# EAGLE schematic BatteryBalancer_SP20 (EAGLE 9.5.0)

## Sheet 1 of 5: Connectors
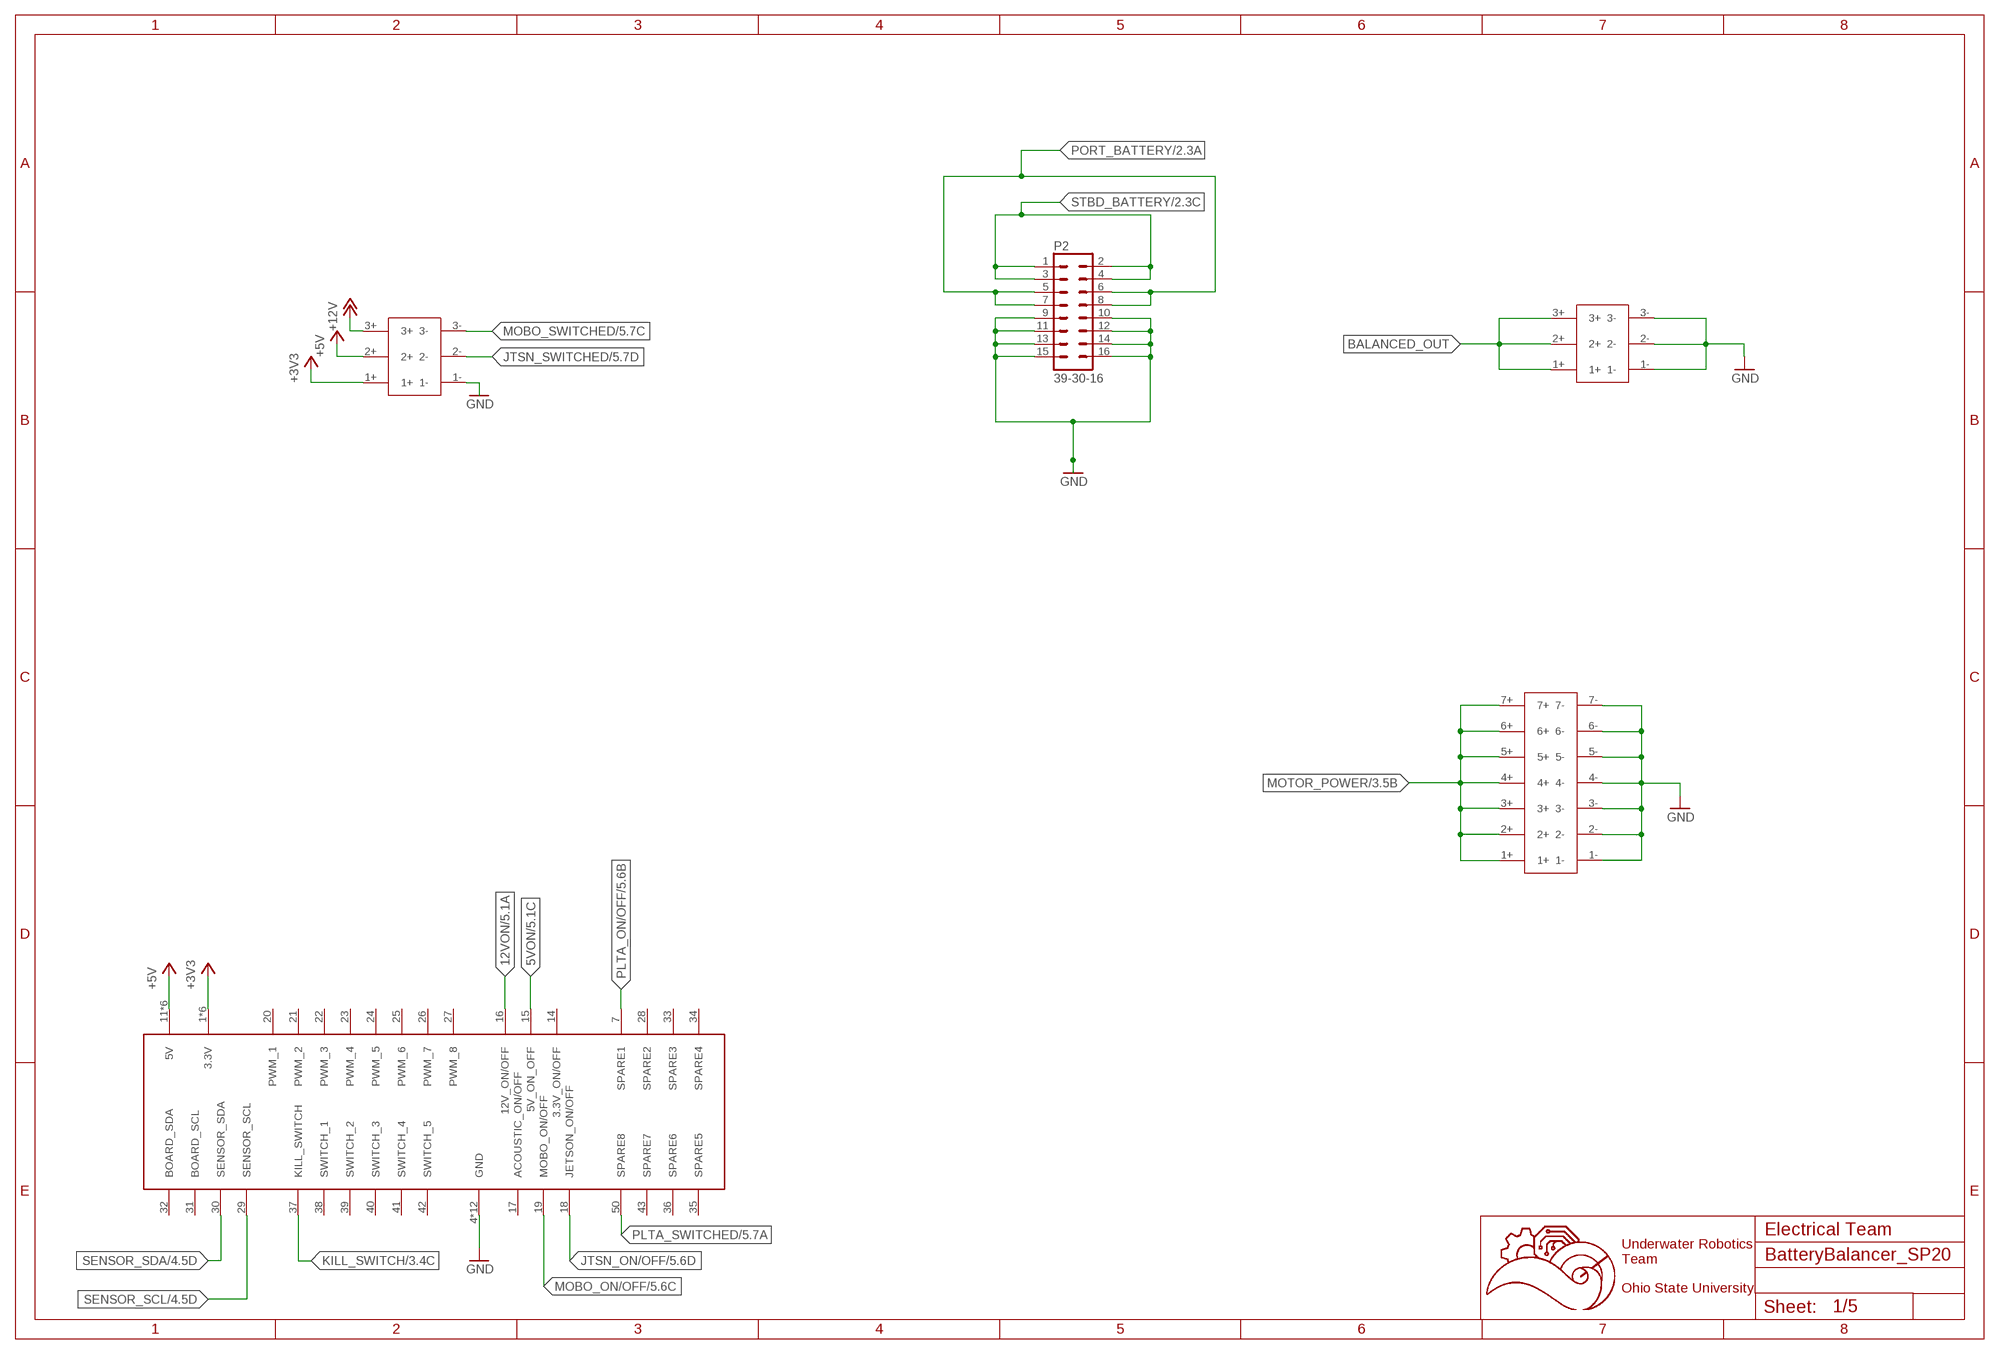
[diagram p0: schematic, sheet 1]

### Parts
P2  39-30-16  [39-30-?16?]
U$1  5530843-EDGE  [5530843-6-BOARDFINGERS]
U$4  14PIN-VERT  [14PIN_VERT]
U$5  6PIN-VERT  [6PIN_VERT]
U$13  6PIN-VERT  [6PIN_VERT]

### Nets
5VON: U$1.15(5V_ON_OFF) ; also sheet 5
12VON: U$1.16(12V_ON/OFF) ; also sheet 5
+3V3: U$1.1(3.3V) U$1.2(3.3V) U$1.3(3.3V) U$1.54(3.3V) U$1.55(3.3V) U$1.56(3.3V) U$5.1+ ; also sheet 2,3,4,5
+5V: U$1.11(5V) U$1.12(5V) U$1.13(5V) U$1.44(5V) U$1.45(5V) U$1.46(5V) U$5.2+ ; also sheet 5
+12V: U$5.3+ ; also sheet 5
BALANCED_OUT: U$13.1+ U$13.2+ U$13.3+ ; also sheet 2,3,4,5
GND: P2.9 P2.10 P2.11 P2.12 P2.13 P2.14 P2.15 P2.16 U$1.4(GND) U$1.5(GND) U$1.6(GND) U$1.8(GND) U$1.9(GND) U$1.10(GND) U$1.47(GND) U$1.48(GND) U$1.49(GND) U$1.51(GND) U$1.52(GND) U$1.53(GND) U$4.1- U$4.2- U$4.3- U$4.4- U$4.5- U$4.6- U$4.7- U$13.1- U$13.2- U$13.3- ; also sheet 2,4,5
GND1: U$5.1- ; supply symbol labelled GND
JTSN_ON/OFF: U$1.18(JETSON_ON/OFF) ; also sheet 5
JTSN_SWITCHED: U$5.2- ; also sheet 5
KILL_SWITCH: U$1.37(KILL_SWITCH) ; also sheet 3
MOBO_ON/OFF: U$1.19(MOBO_ON/OFF) ; also sheet 5
MOBO_SWITCHED: U$5.3- ; also sheet 5
MOTOR_POWER: U$4.1+ U$4.2+ U$4.3+ U$4.4+ U$4.5+ U$4.6+ U$4.7+ ; also sheet 3
PLTA_ON/OFF: U$1.7(SPARE1) ; also sheet 5
PLTA_SWITCHED: U$1.50(SPARE8) ; also sheet 5
PORT_BATTERY: P2.5 P2.6 P2.7 P2.8 ; also sheet 2,4
SENSOR_SCL: U$1.29(SENSOR_SCL) ; also sheet 4
SENSOR_SDA: U$1.30(SENSOR_SDA) ; also sheet 4
STBD_BATTERY: P2.1 P2.2 P2.3 P2.4 ; also sheet 2,4
Unconnected: U$1.14(3.3V_ON/OFF) U$1.17(ACOUSTIC_ON/OFF) U$1.20(PWM_1) U$1.21(PWM_2) U$1.22(PWM_3) U$1.23(PWM_4) U$1.24(PWM_5) U$1.25(PWM_6) U$1.26(PWM_7) U$1.27(PWM_8) U$1.28(SPARE2) U$1.31(BOARD_SCL) U$1.32(BOARD_SDA) U$1.33(SPARE3) U$1.34(SPARE4) U$1.35(SPARE5) U$1.36(SPARE6) U$1.38(SWITCH_1) U$1.39(SWITCH_2) U$1.40(SWITCH_3) U$1.41(SWITCH_4) U$1.42(SWITCH_5) U$1.43(SPARE7)

### Notes on the sheet
- Electrical Team
- Underwater Robotics
  Team
  
  Ohio State University

## Sheet 2 of 5
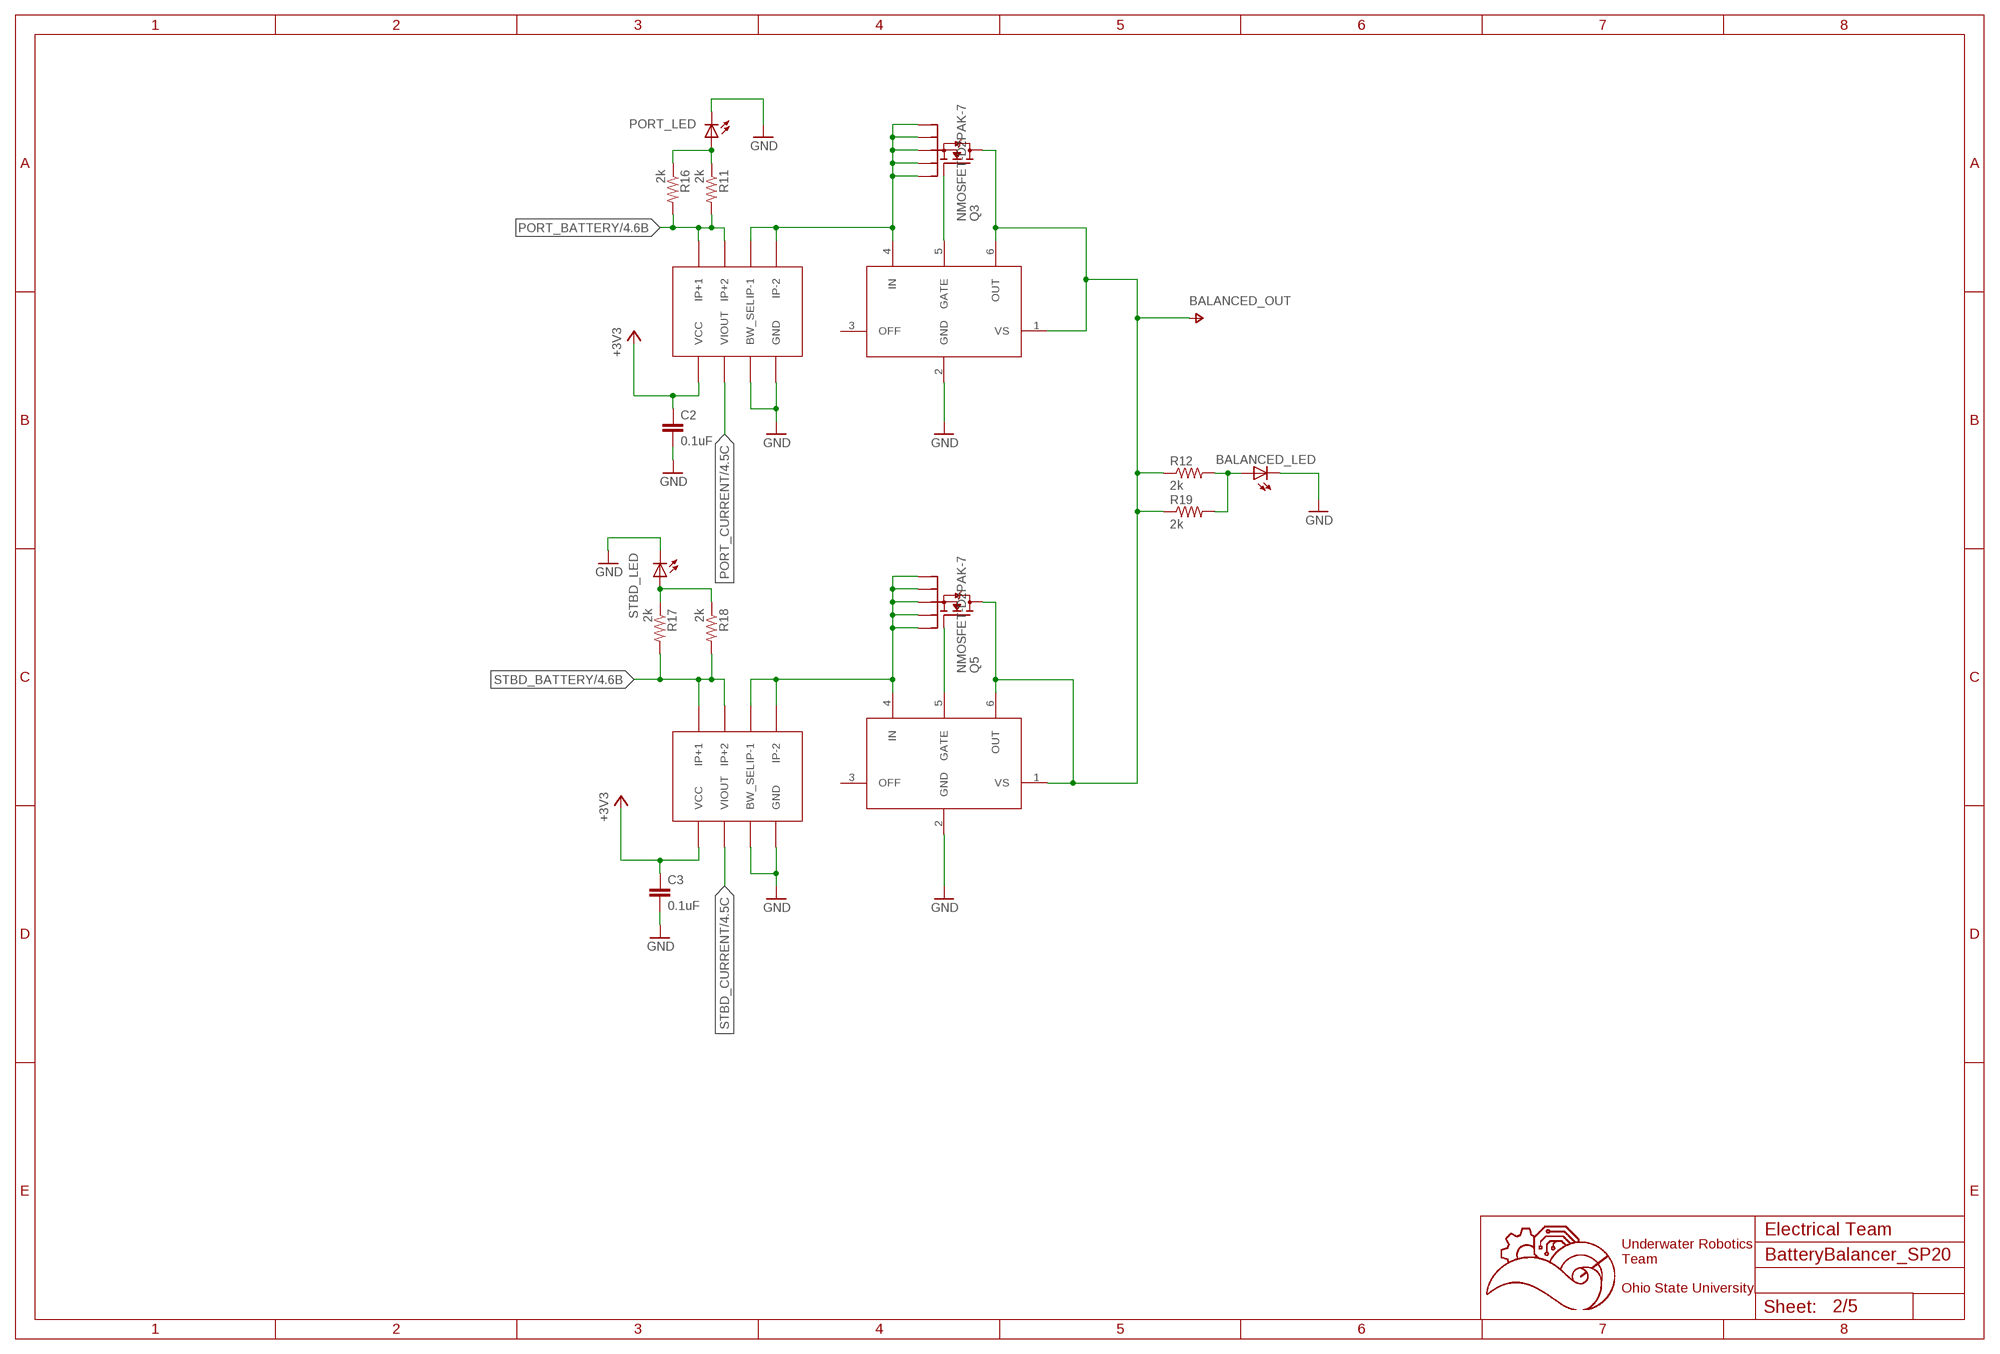
[diagram p1: schematic, sheet 2]

### Parts
BALANCED_LED  LEDCHIP-LED0603  [CHIP-LED0603]
C2  0.1uF  C-EUC0603  [C0603]
C3  0.1uF  C-EUC0603  [C0603]
PORT_LED  LEDCHIP-LED0603  [CHIP-LED0603]
Q3  NMOSFET-D2PAK-7  [D2PAK-7]
Q5  NMOSFET-D2PAK-7  [D2PAK-7]
R11  2k  R-US_R0603  [R0603]
R12  2k  R-US_R0603  [R0603]
R16  2k  R-US_R0603  [R0603]
R17  2k  R-US_R0603  [R0603]
R18  2k  R-US_R0603  [R0603]
R19  2k  R-US_R0603  [R0603]
STBD_LED  LEDCHIP-LED0603  [CHIP-LED0603]
U$2  LM5050  [LM5050]
U$3  LM5050  [LM5050]
U$6  ACS722  [SOIC-8]
U$7  ACS722  [SOIC-8]

### Nets
+3V3: C2.1 C3.1 U$6.VCC U$7.VCC ; also sheet 1,3,4,5
BALANCED_OUT: Q3.D Q5.D R12.1 R19.1 U$2.1(VS) U$2.6(OUT) U$3.1(VS) U$3.6(OUT) ; supply symbol labelled V+ ; also sheet 1,3,4,5
GND: BALANCED_LED.C C2.2 C3.2 PORT_LED.C STBD_LED.C U$2.2(GND) U$3.2(GND) U$6.BW_SEL U$6.GND U$7.BW_SEL U$7.GND ; also sheet 1,4,5
N$1: Q3.S1 Q3.S2 Q3.S3 Q3.S4 Q3.S5 U$2.4(IN) U$6.IP-1 U$6.IP-2
N$2: Q3.G U$2.5(GATE)
N$5: Q5.G U$3.5(GATE)
N$11: PORT_LED.A R11.1 R16.1
N$12: R17.1 R18.1 STBD_LED.A
N$13: BALANCED_LED.A R12.2 R19.2
PORT_BATTERY: R11.2 R16.2 U$6.IP+1 U$6.IP+2 ; also sheet 1,4
PORT_CURRENT: U$6.VIOUT ; also sheet 4
SOURCE: Q5.S1 Q5.S2 Q5.S3 Q5.S4 Q5.S5 U$3.4(IN) U$7.IP-1 U$7.IP-2
STBD_BATTERY: R17.2 R18.2 U$7.IP+1 U$7.IP+2 ; also sheet 1,4
STBD_CURRENT: U$7.VIOUT ; also sheet 4
Unconnected: U$2.3(OFF) U$3.3(OFF)

### Notes on the sheet
- Electrical Team
- Underwater Robotics
  Team
  
  Ohio State University

## Sheet 3 of 5
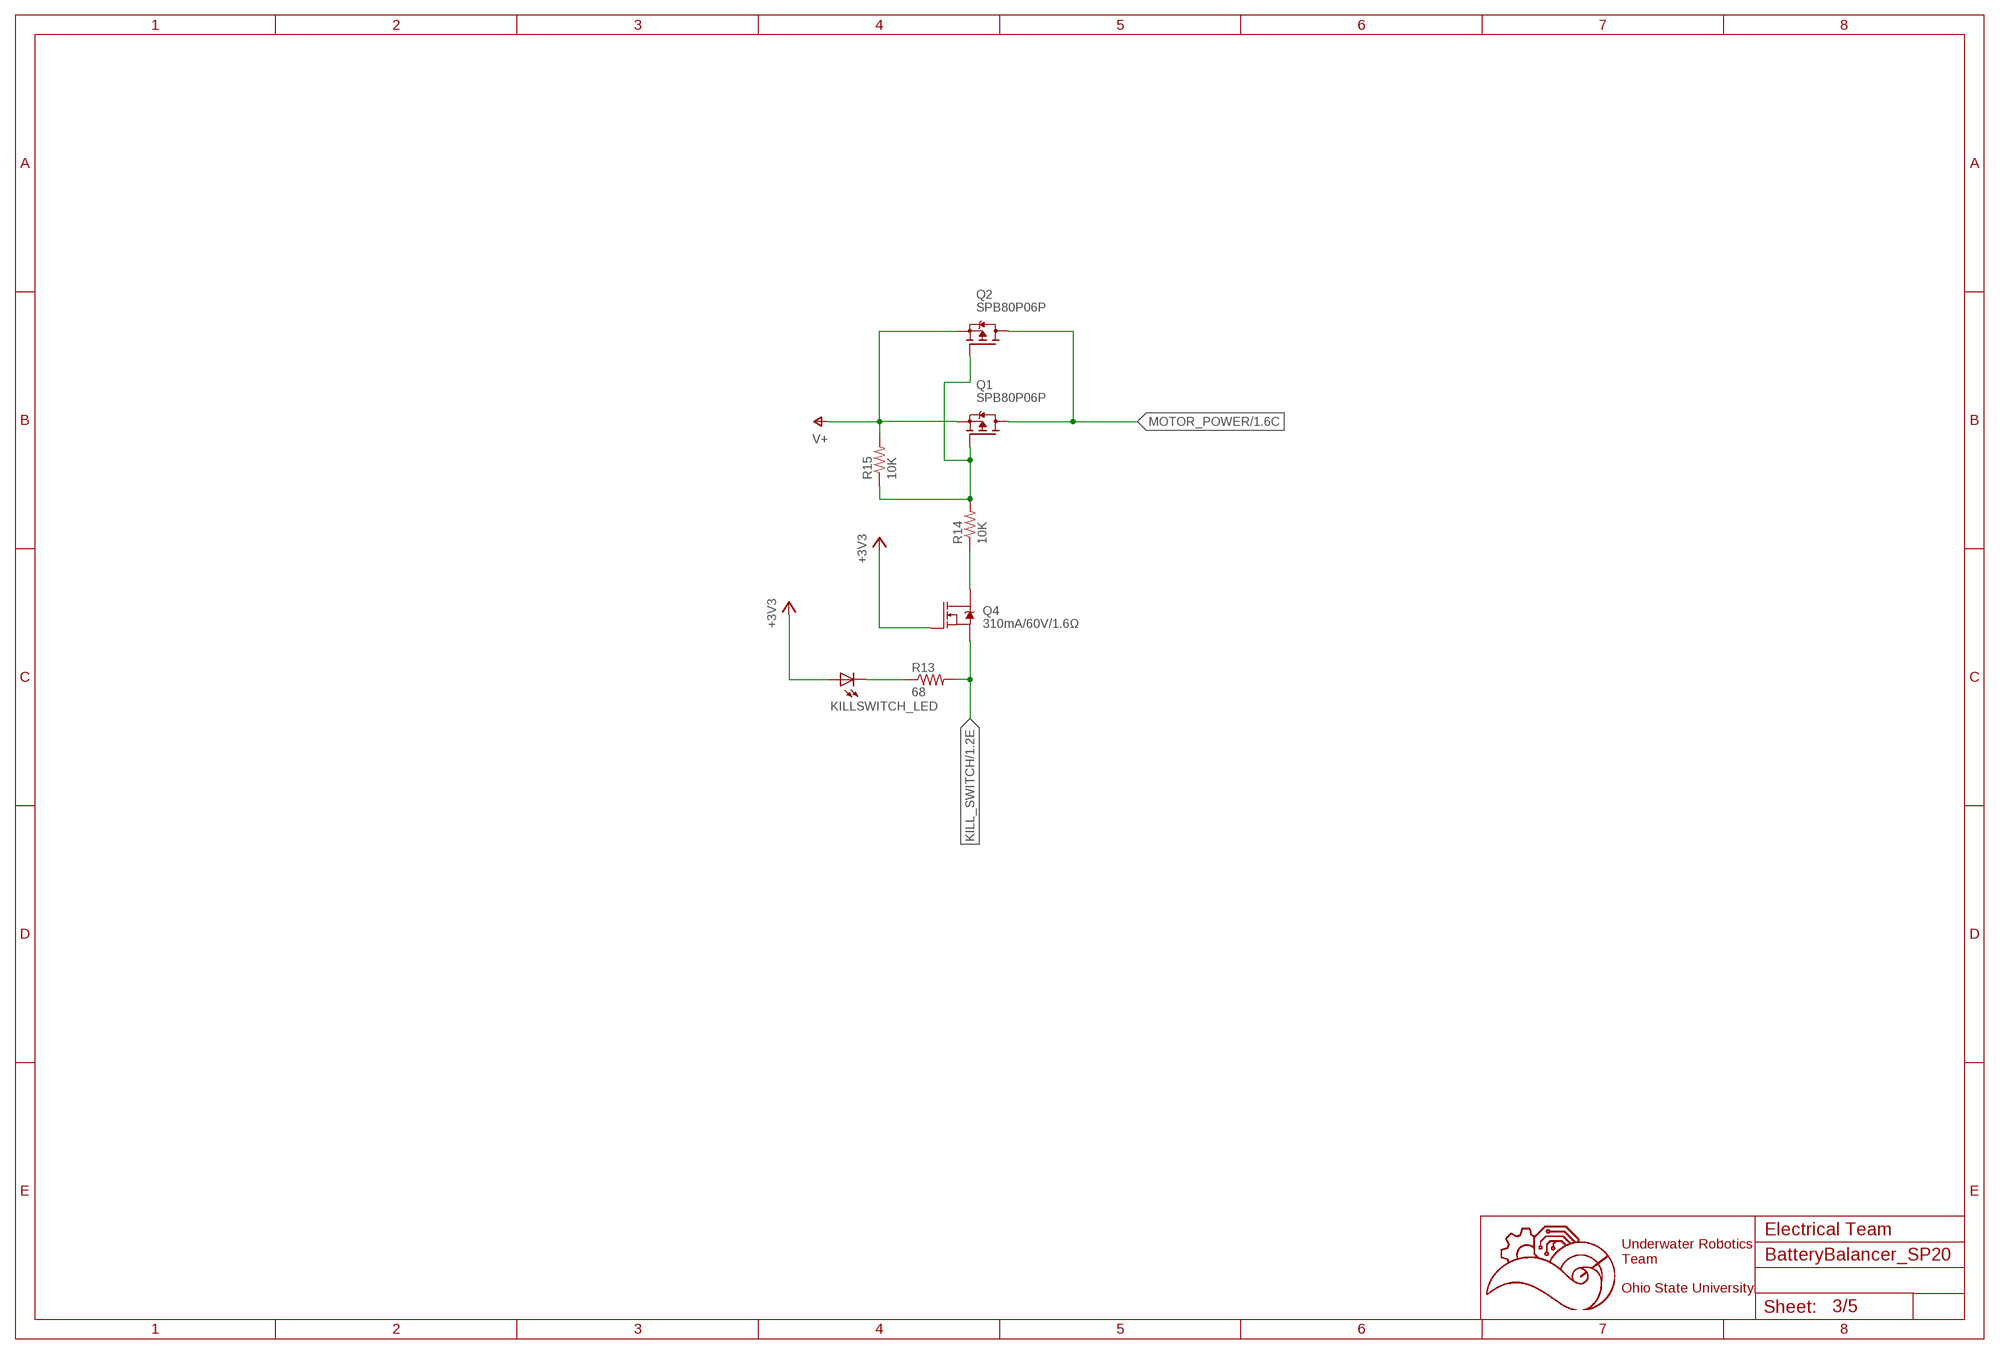
[diagram p2: schematic, sheet 3]

### Parts
KILLSWITCH_LED  LEDCHIP-LED0603  [CHIP-LED0603]
Q1  SPB80P06P  [TO263]
Q2  SPB80P06P  [TO263]
Q4  310mA/60V/1.6Ω  MOSFET-NCH-2N7002PW  [SOT323]
R13  68  R-US_R0603  [R0603]
R14  10K  R-US_R0603  [R0603]
R15  10K  R-US_R0603  [R0603]

### Nets
+3V3: KILLSWITCH_LED.A Q4.1(G) ; also sheet 1,2,4,5
BALANCED_OUT: Q1.2(S) Q2.2(S) R15.2 ; supply symbol labelled V+ ; also sheet 1,2,4,5
KILL_SWITCH: Q4.2(S) R13.2 ; also sheet 1
MOTOR_POWER: Q1.3(D) Q2.3(D) ; also sheet 1
N$4: Q4.3(D) R14.1
N$8: Q1.1(G) Q2.1(G) R14.2 R15.1
N$16: KILLSWITCH_LED.C R13.1

### Notes on the sheet
- Electrical Team
- Underwater Robotics
  Team
  
  Ohio State University

## Sheet 4 of 5
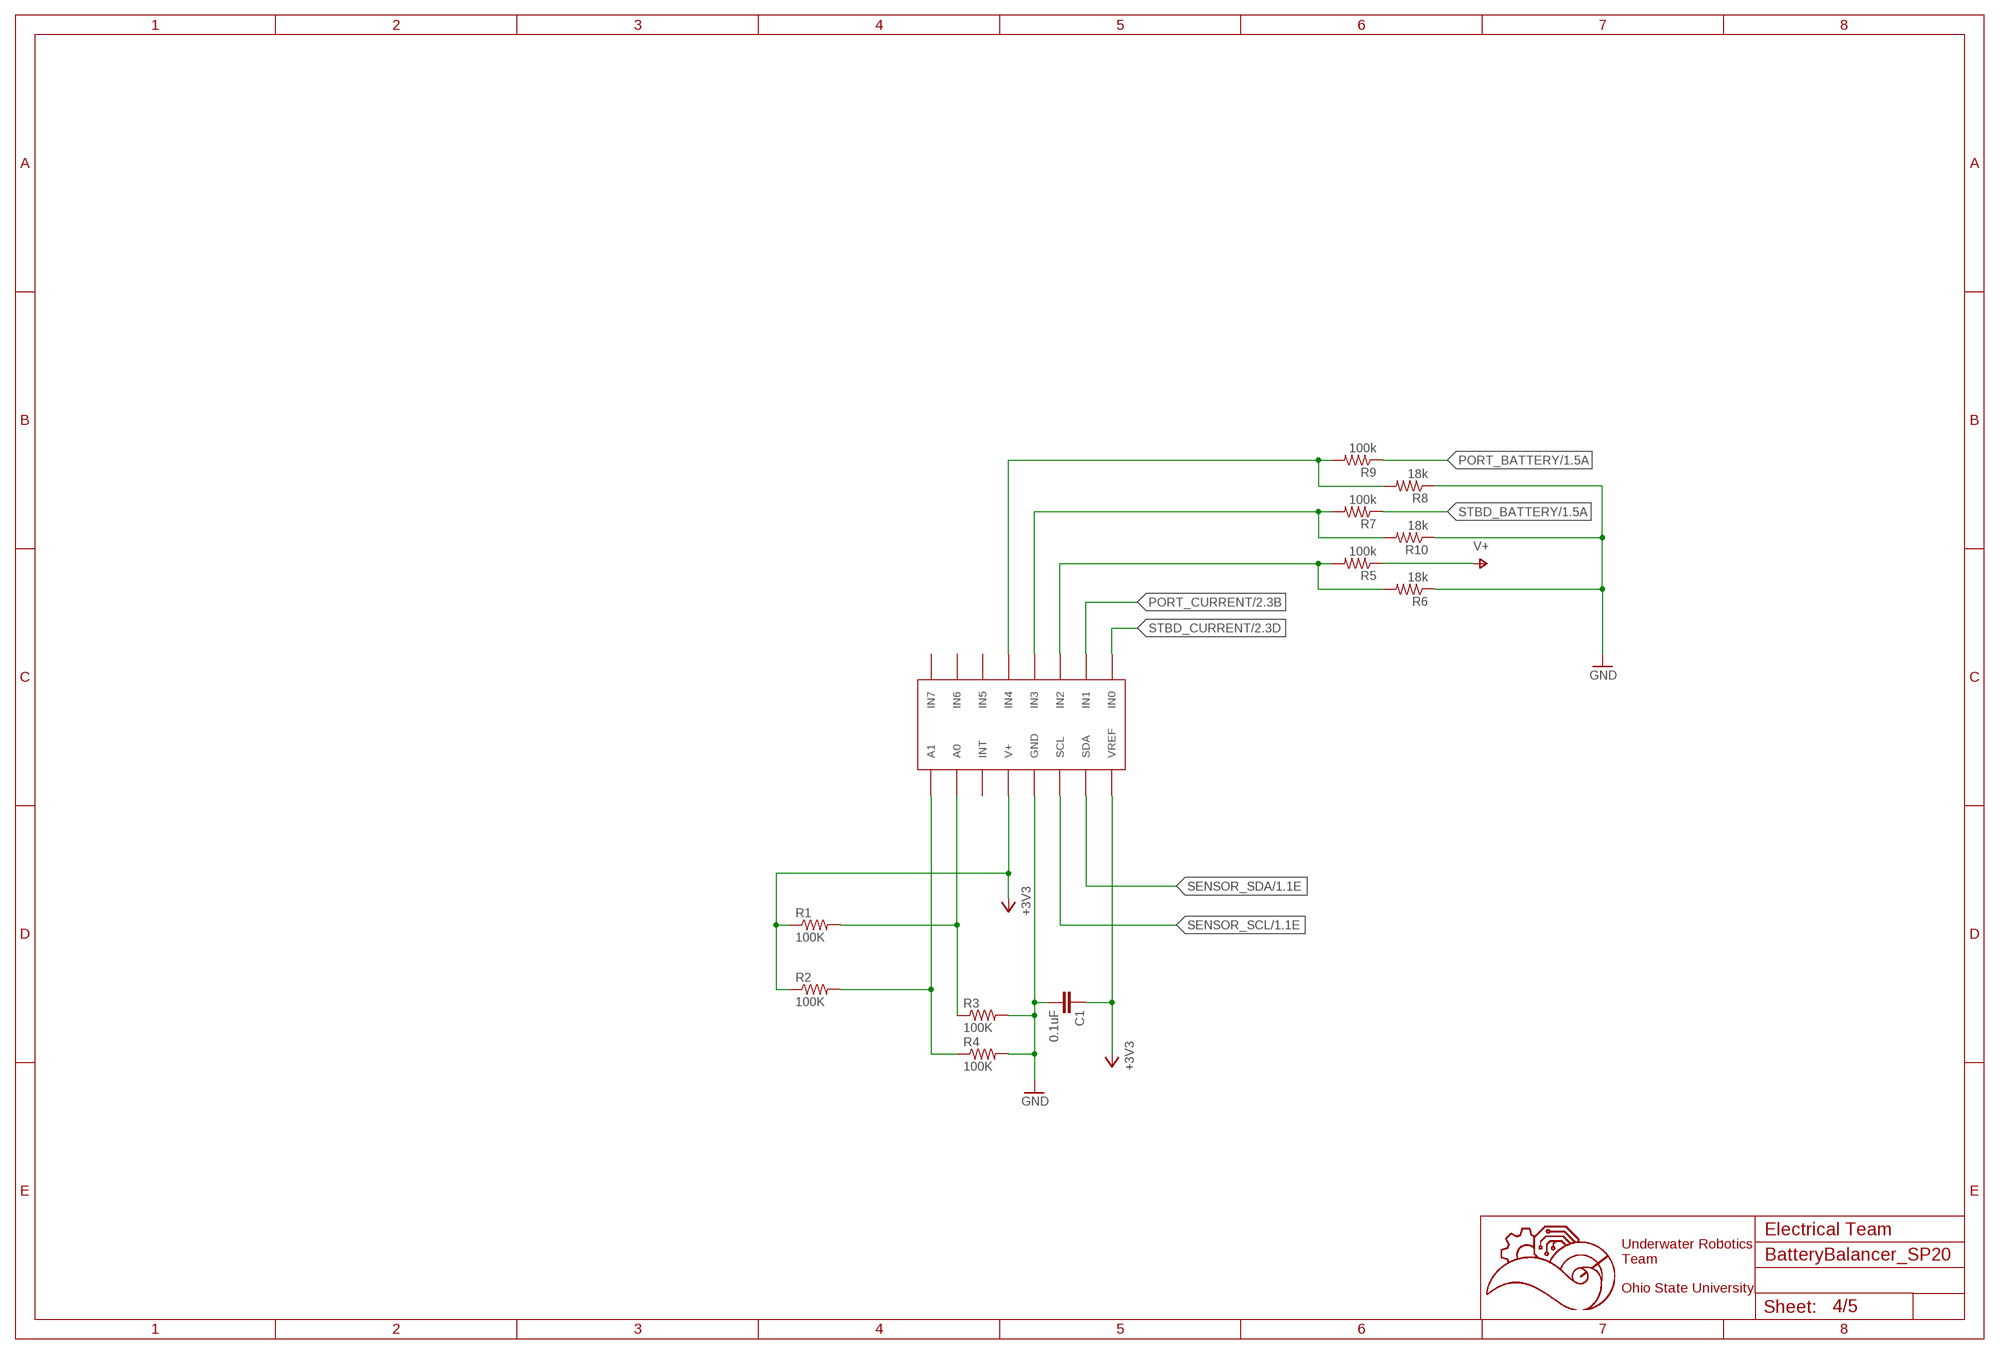
[diagram p3: schematic, sheet 4]

### Parts
C1  0.1uF  C-EUC0603  [C0603]
R1  100K  R-US_R0603  [R0603]
R2  100K  R-US_R0603  [R0603]
R3  100K  R-US_R0603  [R0603]
R4  100K  R-US_R0603  [R0603]
R5  100k  R-US_R0603  [R0603]
R6  18k  R-US_R0603  [R0603]
R7  100k  R-US_R0603  [R0603]
R8  18k  R-US_R0603  [R0603]
R9  100k  R-US_R0603  [R0603]
R10  18k  R-US_R0603  [R0603]
U$12  ADC128D818  [TSSOP-16]

### Nets
+3V3: C1.1 R1.1 R2.1 U$12.V+ U$12.VREF ; also sheet 1,2,3,5
BALANCED_OUT: R5.1 ; supply symbol labelled V+ ; also sheet 1,2,3,5
GND: C1.2 R3.2 R4.2 R6.1 R8.1 R10.1 U$12.GND ; also sheet 1,2,5
N$6: R2.2 R4.1 U$12.A1
N$7: R1.2 R3.1 U$12.A0
N$9: R7.2 R10.2 U$12.IN3
N$10: R8.2 R9.2 U$12.IN4
N$15: R5.2 R6.2 U$12.IN2
PORT_BATTERY: R9.1 ; also sheet 1,2
PORT_CURRENT: U$12.IN1 ; also sheet 2
SENSOR_SCL: U$12.SCL ; also sheet 1
SENSOR_SDA: U$12.SDA ; also sheet 1
STBD_BATTERY: R7.1 ; also sheet 1,2
STBD_CURRENT: U$12.IN0 ; also sheet 2
Unconnected: U$12.IN5 U$12.IN6 U$12.IN7 U$12.INT

### Notes on the sheet
- Electrical Team
- Underwater Robotics
  Team
  
  Ohio State University

## Sheet 5 of 5
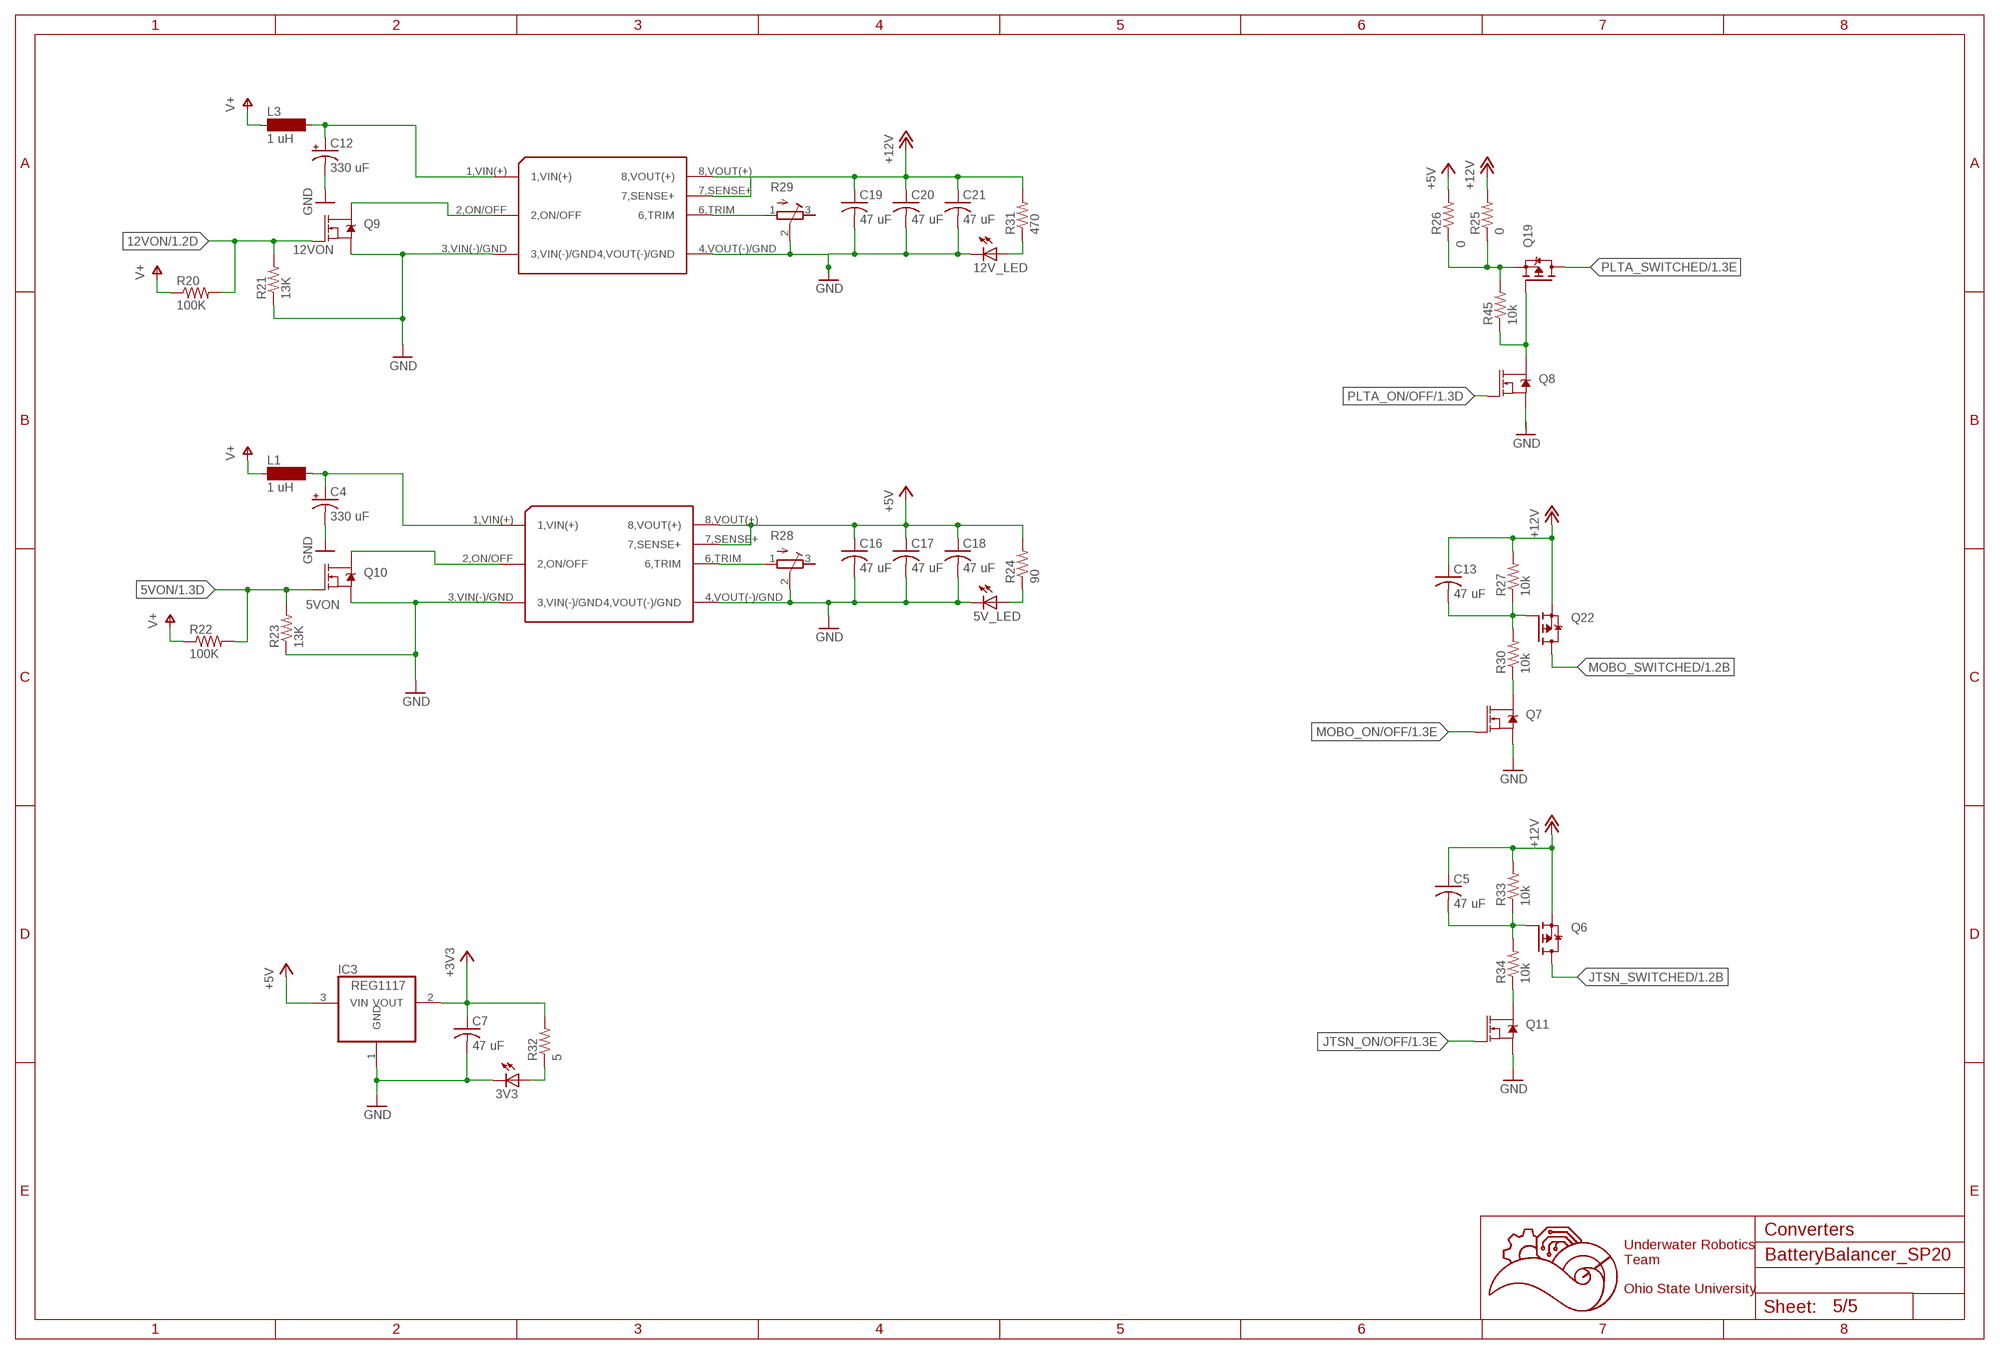
[diagram p4: schematic, sheet 5]

### Parts
3V3  LEDCHIPLED_0603  [CHIPLED_0603]
5V_LED  LEDCHIPLED_0603  [CHIPLED_0603]
5VCONVERTER  CONVERTER  [CONVERTER]
12V_LED  LEDCHIPLED_0603  [CHIPLED_0603]
12VCONVERTER  CONVERTER  [CONVERTER]
C4  330 uF  CPOL-USE5-10.5  [E5-10,5]
C5  47 uF  C-USC1206K  [C1206K]
C7  47 uF  C-USC1206K  [C1206K]
C12  330 uF  CPOL-USE5-10.5  [E5-10,5]
C13  47 uF  C-USC1206K  [C1206K]
C16  47 uF  C-USC1206K  [C1206K]
C17  47 uF  C-USC1206K  [C1206K]
C18  47 uF  C-USC1206K  [C1206K]
C19  47 uF  C-USC1206K  [C1206K]
C20  47 uF  C-USC1206K  [C1206K]
C21  47 uF  C-USC1206K  [C1206K]
IC3  REG1117  [SOT223]
L1  1 uH  MS85  [MS85]
L3  1 uH  MS85  [MS85]
Q6  FDD4141TO252  [TO252]
Q7  MOSFET-NCH-AO3404A  [SOT23-3]
Q8  MOSFET-NCH-AO3404A  [SOT23-3]
Q9  MOSFET-NCH-AO3404A  [SOT23-3]
Q10  MOSFET-NCH-AO3404A  [SOT23-3]
Q11  MOSFET-NCH-AO3404A  [SOT23-3]
Q19  FDD4141TO252  [TO252]
Q22  FDD4141TO252  [TO252]
R20  100K  R-US_R0603  [R0603]
R21  13K  R-US_R0603  [R0603]
R22  100K  R-US_R0603  [R0603]
R23  13K  R-US_R0603  [R0603]
R24  90  R-US_R0603  [R0603]
R25  0  R-US_M2309  [M2309]
R26  0  R-US_M2309  [M2309]
R27  10k  R-US_R0603  [R0603]
R28  R-TRIMM3103  [RTRIM3103]
R29  R-TRIMM3103  [RTRIM3103]
R30  10k  R-US_R0603  [R0603]
R31  470  R-US_R0603  [R0603]
R32  5  R-US_R0603  [R0603]
R33  10k  R-US_R0603  [R0603]
R34  10k  R-US_R0603  [R0603]
R45  10k  R-US_R0603  [R0603]

### Nets
5VON: Q10.1(G) R22.2 R23.2 ; also sheet 1
12VON: Q9.1(G) R20.2 R21.2 ; also sheet 1
+3V3: C7.1 IC3.2(VOUT) R32.2 ; also sheet 1,2,3,4
+5V: 5VCONVERTER.7,SENSE+ 5VCONVERTER.8,VOUT(+) C16.1 C17.1 C18.1 IC3.3(VIN) R24.2 R26.2 ; also sheet 1
+12V: 12VCONVERTER.7,SENSE+ 12VCONVERTER.8,VOUT(+) C5.1 C13.1 C19.1 C20.1 C21.1 Q6.2(S) Q22.2(S) R25.2 R27.2 R31.2 R33.2 ; also sheet 1
BALANCED_OUT: L1.1 L3.1 R20.1 R22.1 ; supply symbol labelled V+ ; also sheet 1,2,3,4
GND: 3V3.C 5V_LED.C 5VCONVERTER.3,VIN(-)/GND 5VCONVERTER.4,VOUT(-)/GND 12V_LED.C 12VCONVERTER.3,VIN(-)/GND 12VCONVERTER.4,VOUT(-)/GND C4.- C7.2 C12.- C16.2 C17.2 C18.2 C19.2 C20.2 C21.2 IC3.1(GND) Q7.2(S) Q8.2(S) Q9.2(S) Q10.2(S) Q11.2(S) R21.1 R23.1 R28.2(S) R29.2(S) ; also sheet 1,2,4
JTSN_ON/OFF: Q11.1(G) ; also sheet 1
JTSN_SWITCHED: Q6.3(D) ; also sheet 1
MOBO_ON/OFF: Q7.1(G) ; also sheet 1
MOBO_SWITCHED: Q22.3(D) ; also sheet 1
N$3: 12VCONVERTER.6,TRIM R29.1(A)
N$14: 5VCONVERTER.6,TRIM R28.1(A)
N$17: C13.2 Q22.1(G) R27.1 R30.2
N$18: 12VCONVERTER.2,ON/OFF Q9.3(D)
N$19: 5VCONVERTER.2,ON/OFF Q10.3(D)
N$20: Q7.3(D) R30.1
N$21: Q19.2(S) R25.1 R26.1 R45.2
N$22: Q8.3(D) Q19.1(G) R45.1
N$23: 12VCONVERTER.1,VIN(+) C12.+ L3.2
N$24: 5VCONVERTER.1,VIN(+) C4.+ L1.2
N$25: 5V_LED.A R24.1
N$26: C5.2 Q6.1(G) R33.1 R34.2
N$27: 12V_LED.A R31.1
N$28: 3V3.A R32.1
N$29: Q11.3(D) R34.1
PLTA_ON/OFF: Q8.1(G) ; also sheet 1
PLTA_SWITCHED: Q19.3(D) ; also sheet 1
Unconnected: R28.3(E) R29.3(E)

### Notes on the sheet
- Converters
- Underwater Robotics
  Team
  
  Ohio State University
- C:/Users/blain/Downloads/Black and White.bmp

## Library data of the parts
3V3 5V_LED 12V_LED BALANCED_LED KILLSWITCH_LED PORT_LED STBD_LED = led:LED: LED OSRAM: - CHIPLED LG R971, LG N971, LY N971, LG Q971, LY Q971, LO R971, LY R971 LH N974, LH R974 LS Q976, LO Q976, LY Q976 LO Q996 - Hyper CHIPLED LW Q18S LB Q993, LB Q99A, LB R99A - SideLED LS A670, LO A670, LY A670, LG A670, LP A670 LB A673, LV A673, LT A673, LW A673 LH A674 LY A675 LS A676, LA A676, LO A676, LY A676, LW A676 LS A679, LY A679, LG A679 - Hyper Micro SIDELED® LS Y876, LA Y876, LO Y876, LY Y876 LT Y87S - SmartLED LW L88C, LW L88S LB L89C, LB L89S, LG L890 LS L89K, LO L89K, LY L89K LS L896, LA L896, LO L896, LY L896 - TOPLED LS T670, LO T670, LY T670, LG T670, LP T670 LSG T670, LSP T670, LSY T670, LOP T670, LYG T670 LG T671, LOG T671, LSG T671 LB T673, LV T673, LT T673, LW T673 LH T674 LS T676, LA T676, LO T676, LY T676, LB T676, LH T676, LSB T676, LW T676 LB T67C, LV T67C, LT T67C, LS T67K, LO T67K, LY T67K, LW E67C LS E67B, LA E67B, LO E67B, LY E67B, LB E67C, LV E67C, LT E67C LW T67C LS T679, LY T679, LG T679 LS T770, LO T770, LY T770, LG T770, LP T770 LB T773, LV T773, LT T773, LW T773 LH T774 LS E675, LA E675, LY E675, LS T675 LS T776, LA T776, LO T776, LY T776, LB T776 LHGB T686 LT T68C, LB T68C - Hyper Mini TOPLED® LB M676 - Mini TOPLED Santana® LG M470 LS M47K, LO M47K, LY M47K Source: http://www.osram.convergy.de LUXEON: - LUMILED® LXK2-PW12-R00, LXK2-PW12-S00, LXK2-PW14-U00, LXK2-PW14-V00 LXK2-PM12-R00, LXK2-PM12-S00, LXK2-PM14-U00 LXK2-PE12-Q00, LXK2-PE12-R00, LXK2-PE12-S00, LXK2-PE14-T00, LXK2-PE14-U00 LXK2-PB12-K00, LXK2-PB12-L00, LXK2-PB12-M00, LXK2-PB14-N00, LXK2-PB14-P00, LXK2-PB14-Q00 LXK2-PR12-L00, LXK2-PR12-M00, LXK2-PR14-Q00, LXK2-PR14-R00 LXK2-PD12-Q00, LXK2-PD12-R00, LXK2-PD12-S00 LXK2-PH12-R00, LXK2-PH12-S00 LXK2-PL12-P00, LXK2-PL12-Q00, LXK2-PL12-R00 Source: www.luxeon.com KINGBRIGHT: KA-3528ASYC Source: www.kingbright.com
5VCONVERTER 12VCONVERTER = converter:CONVERTER
C1-C3 = rcl:C-EU: CAPACITOR, European symbol; SPICEPREFIX: C
C4 C12 = rcl:CPOL-US: POLARIZED CAPACITOR, American symbol; SPICEPREFIX: C
C5 C7 C13 C16-C21 = resistor:C-US: CAPACITOR, American symbol
IC3 = burr-brown:REG1117: 800mA and 1A Low Dropout (LDO) Positive Regulator 1.8V, 2.5V, 2.85V, 3.3V, 5V, and Adj; MPN: REG1117; OC_FARNELL: 1097566; OC_NEWARK: 14P6981
L1 L3 = inductor-neosid:MS85: INDUCTOR SMD power inductor; OC_FARNELL: unknown; OC_NEWARK: unknown
P2 = con-molex-mini-fit:39-30-?16?: HEADER
Q1 Q2 = transistor-fet:SPB80P06P: SIPMOS (R) Power-Transistor P-Channel, Enhancement mode Source: http://www.infineon.com/upload/Document/cmc_upload/documents/011/3685/SPP80P06P.pdf
Q3 Q5 = D2PAK-7:NMOSFET-D2PAK-7
Q4 = SparkFun-DiscreteSemi:MOSFET-NCH: N-channel MOSFETs Voltage controlled devices that allow control of high current outputs. SparkFun Products: SparkFun OpenScale <https://www.sparkfun.com/products/13261> SparkFun Digital Sandbox <https://www.sparkfun.com/products/12651> SparkFun Monster Moto Shield <https://www.sparkfun.com/products/10182> SparkFun MOSFET Power Controller <https://www.sparkfun.com/products/11214>; PROD_ID: TRANS-11151
Q6 Q19 Q22 = transistor-fet:FDD4141: P-Channel PowerTrench® MOSFET Source: FDD4141.pdf
Q7-Q11 = SparkFun-DiscreteSemi:MOSFET-NCH: N-channel MOSFETs Voltage controlled devices that allow control of high current outputs. SparkFun Products: SparkFun OpenScale <https://www.sparkfun.com/products/13261> SparkFun Digital Sandbox <https://www.sparkfun.com/products/12651> SparkFun Monster Moto Shield <https://www.sparkfun.com/products/10182> SparkFun MOSFET Power Controller <https://www.sparkfun.com/products/11214>; PROD_ID: TRANS-12988; VALUE: 5.8A/30V/35mΩ
R1-R24 R31 R32 = rcl:R-US_: RESISTOR, American symbol; SPICEPREFIX: R
R25-R27 R30 R33 R34 R45 = resistor:R-US_: RESISTOR, American symbol
R28 R29 = rcl:R-TRIMM: Trimm resistor; SPICEMODEL: X; SPICEPREFIXL: POT
U$1 = 5530843-6:5530843-EDGE
U$2 U$3 = LM5050:LM5050
U$4 = Vertical_Connectors:14PIN-VERT
U$5 U$13 = Vertical_Connectors:6PIN-VERT
U$6 U$7 = ACS722:ACS722
U$12 = ADC128D818:ADC128D818